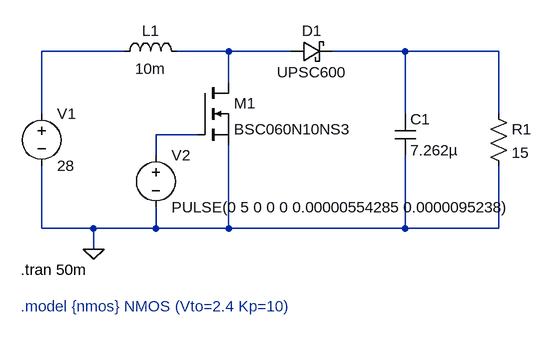
[diagram p0: schematic boost_circuit.asc]
boost_circuit.asc, the LTspice schematic file:
Version 4
SHEET 1 880 680
WIRE 96 48 -32 48
WIRE 256 48 176 48
WIRE 352 48 256 48
WIRE 528 48 416 48
WIRE 672 48 528 48
WIRE 256 96 256 48
WIRE -32 144 -32 48
WIRE 528 144 528 48
WIRE 672 144 672 48
WIRE 208 176 144 176
WIRE 144 208 144 176
WIRE -32 320 -32 224
WIRE 48 320 -32 320
WIRE 144 320 144 288
WIRE 144 320 48 320
WIRE 256 320 256 192
WIRE 256 320 144 320
WIRE 528 320 528 208
WIRE 528 320 256 320
WIRE 672 320 672 224
WIRE 672 320 528 320
WIRE 48 352 48 320
FLAG 48 352 0
SYMBOL voltage -32 128 R0
WINDOW 123 0 0 Left 0
WINDOW 39 0 0 Left 0
SYMATTR InstName V1
SYMATTR Value 28
SYMBOL ind 80 64 R270
WINDOW 0 32 56 VTop 2
WINDOW 3 5 56 VBottom 2
SYMATTR InstName L1
SYMATTR Value 10m
SYMBOL cap 512 144 R0
SYMATTR InstName C1
SYMATTR Value 7.262µ
SYMBOL res 656 128 R0
SYMATTR InstName R1
SYMATTR Value 15
SYMBOL voltage 144 192 R0
WINDOW 123 0 0 Left 0
WINDOW 39 0 0 Left 0
SYMATTR InstName V2
SYMATTR Value PULSE(0 5 0 0 0 0.00000554285 0.0000095238)
SYMBOL schottky 352 64 R270
WINDOW 0 32 32 VTop 2
WINDOW 3 0 32 VBottom 2
SYMATTR InstName D1
SYMATTR Value UPSC600
SYMATTR Description Diode
SYMATTR Type diode
SYMBOL nmos 208 96 R0
SYMATTR InstName M1
SYMATTR Value BSC060N10NS3
TEXT -64 384 Left 2 !.tran 50m
TEXT -64 440 Left 2 ;.model {nmos} NMOS (Vto=2.4 Kp=10)

The netlist it stands for:
* boost_circuit.asc
V1 N001 0 28
L1 N001 N002 10m
C1 N003 0 7.262µ
R1 N003 0 15
V2 N004 0 PULSE(0 5 0 0 0 0.00000554285 0.0000095238)
D1 N002 N003 UPSC600
M1 N002 N004 0 0 BSC060N10NS3
.model D D
.lib standard.dio
.model NMOS NMOS
.model PMOS PMOS
.lib standard.mos
.tran 50m
* .model {nmos} NMOS (Vto=2.4 Kp=10)
.backanno
.end